# Altium schematic sheet TLD.SchDoc
size 302 x 195 mm; SheetNumber: 1; SheetTotal: 7
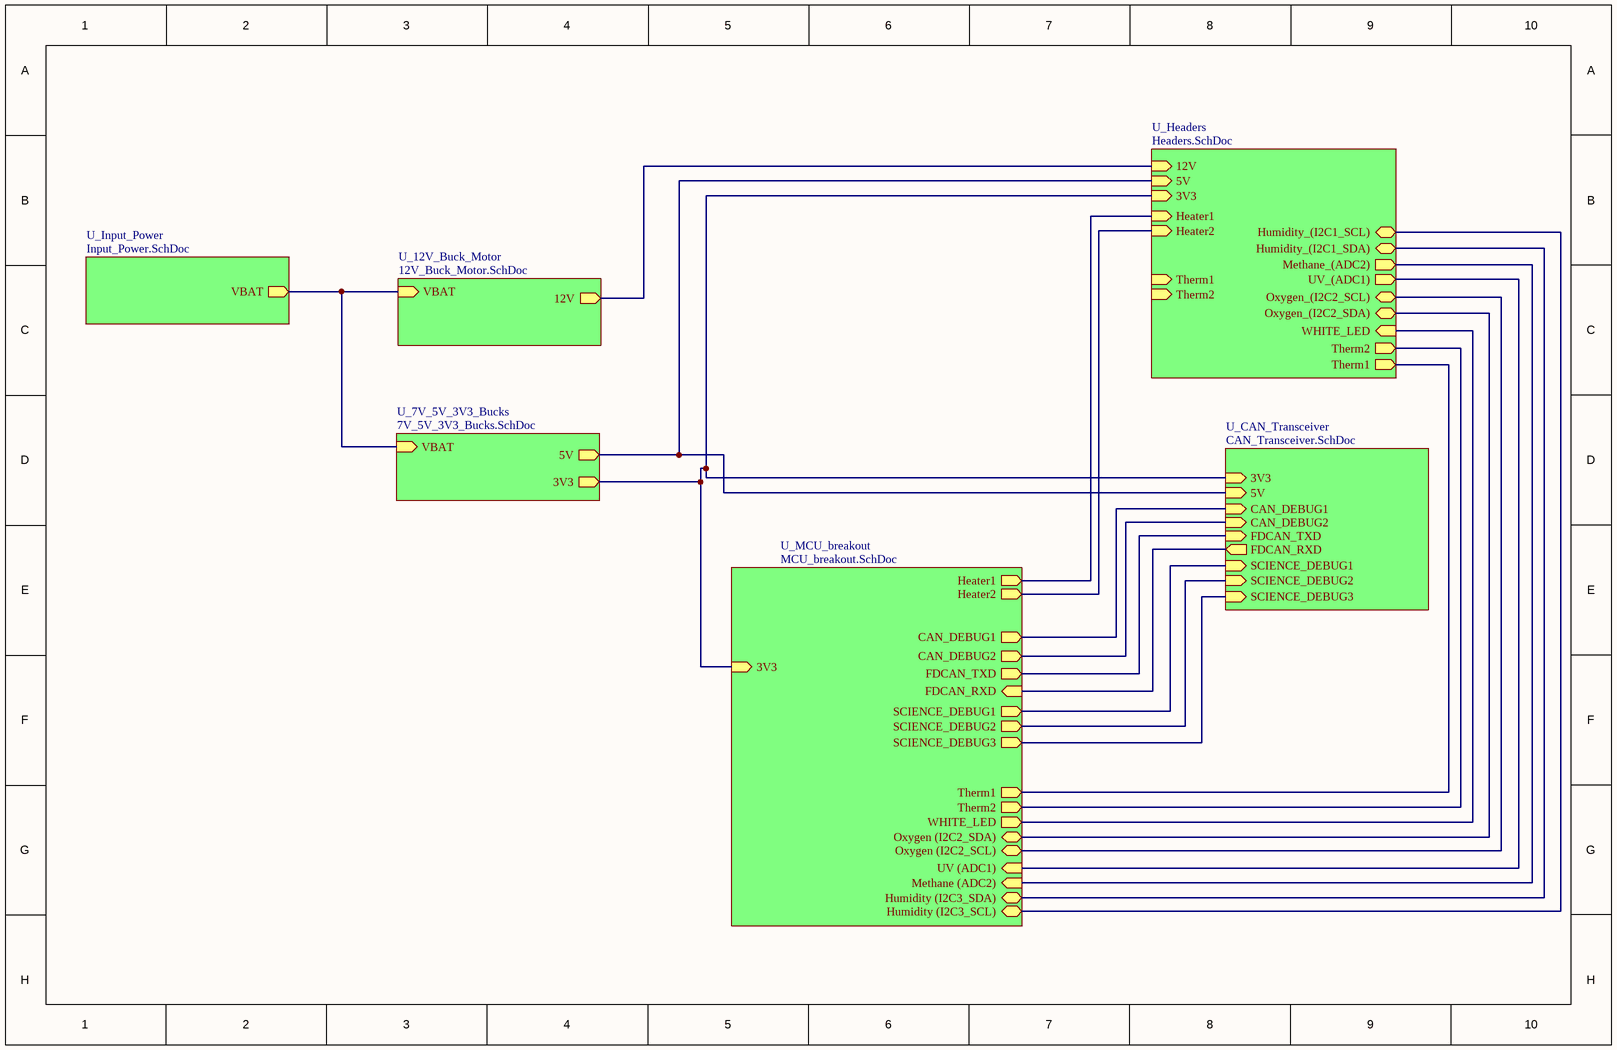
[diagram p0: TLD.SchDoc]

## Sub-sheets
U_7V_5V_3V3_Bucks = 7V_5V_3V3_Bucks.SchDoc: VBAT (in), 3V3 (out), 5V (out)
U_12V_Buck_Motor = 12V_Buck_Motor.SchDoc: 12V (out), VBAT (in)
U_CAN_Transceiver = CAN_Transceiver.SchDoc: CAN_DEBUG1 (in), CAN_DEBUG2 (in), FDCAN_TXD (in), FDCAN_RXD (out), 3V3 (in), 5V (in), SCIENCE_DEBUG1 (in), SCIENCE_DEBUG2 (in), SCIENCE_DEBUG3 (in)
U_Headers = Headers.SchDoc: Methane_(ADC2) (out), UV_(ADC1) (out), Heater1 (in), Heater2 (in), Therm1 (out), Therm2 (out), 12V (in), 5V (in), 3V3 (in), Therm1 (in), Therm2 (in), WHITE_LED (in), Humidity_(I2C1_SDA) (bidir), Humidity_(I2C1_SCL) (bidir), Oxygen_(I2C2_SCL) (bidir), Oxygen_(I2C2_SDA) (bidir)
U_Input_Power = Input_Power.SchDoc: VBAT (out)
U_MCU_breakout = MCU_breakout.SchDoc: Heater1 (out), Heater2 (out), Therm1 (out), Therm2 (out), CAN_DEBUG1 (out), CAN_DEBUG2 (out), FDCAN_TXD (out), FDCAN_RXD (in), 3V3 (in), Humidity (I2C3_SCL) (bidir), WHITE_LED (out), Oxygen (I2C2_SDA) (bidir), Oxygen (I2C2_SCL) (bidir), UV (ADC1) (in), Methane (ADC2) (in), Humidity (I2C3_SDA) (bidir), SCIENCE_DEBUG3 (out), SCIENCE_DEBUG1 (out), SCIENCE_DEBUG2 (out)

## Nets
(unnamed): sheet U_12V_Buck_Motor/12V, sheet U_Headers/12V
(unnamed): sheet U_12V_Buck_Motor/VBAT, sheet U_7V_5V_3V3_Bucks/VBAT, sheet U_Input_Power/VBAT
(unnamed): sheet U_CAN_Transceiver/CAN_DEBUG1, sheet U_MCU_breakout/CAN_DEBUG1
(unnamed): sheet U_CAN_Transceiver/CAN_DEBUG2, sheet U_MCU_breakout/CAN_DEBUG2
(unnamed): sheet U_CAN_Transceiver/FDCAN_TXD, sheet U_MCU_breakout/FDCAN_TXD
(unnamed): sheet U_CAN_Transceiver/FDCAN_RXD, sheet U_MCU_breakout/FDCAN_RXD
(unnamed): sheet U_CAN_Transceiver/3V3, sheet U_7V_5V_3V3_Bucks/3V3, sheet U_Headers/3V3, sheet U_MCU_breakout/3V3
(unnamed): sheet U_CAN_Transceiver/5V, sheet U_7V_5V_3V3_Bucks/5V, sheet U_Headers/5V
(unnamed): sheet U_CAN_Transceiver/SCIENCE_DEBUG1, sheet U_MCU_breakout/SCIENCE_DEBUG1
(unnamed): sheet U_CAN_Transceiver/SCIENCE_DEBUG2, sheet U_MCU_breakout/SCIENCE_DEBUG2
(unnamed): sheet U_CAN_Transceiver/SCIENCE_DEBUG3, sheet U_MCU_breakout/SCIENCE_DEBUG3
(unnamed): sheet U_Headers/Methane_(ADC2), sheet U_MCU_breakout/Methane (ADC2)
(unnamed): sheet U_Headers/UV_(ADC1), sheet U_MCU_breakout/UV (ADC1)
(unnamed): sheet U_Headers/Heater1, sheet U_MCU_breakout/Heater1
(unnamed): sheet U_Headers/Heater2, sheet U_MCU_breakout/Heater2
(unnamed): sheet U_Headers/Therm1, sheet U_MCU_breakout/Therm1
(unnamed): sheet U_Headers/Therm2, sheet U_MCU_breakout/Therm2
(unnamed): sheet U_Headers/WHITE_LED, sheet U_MCU_breakout/WHITE_LED
(unnamed): sheet U_Headers/Humidity_(I2C1_SDA), sheet U_MCU_breakout/Humidity (I2C3_SDA)
(unnamed): sheet U_Headers/Humidity_(I2C1_SCL), sheet U_MCU_breakout/Humidity (I2C3_SCL)
(unnamed): sheet U_Headers/Oxygen_(I2C2_SCL), sheet U_MCU_breakout/Oxygen (I2C2_SCL)
(unnamed): sheet U_Headers/Oxygen_(I2C2_SDA), sheet U_MCU_breakout/Oxygen (I2C2_SDA)

## Notes on the sheet
- DWG. NO.
- REV.
- SHT.
- REVISION
- DESCRIPTION
- DATE
- APPROVED
- THIS DOCUMENT AND THE DATA DISCLOSED HEREIN OR HEREWITH IS THE PROPERTY OF ALTIUM LIMITED AND MAY BE FREELY DISTRIBUTED IN WHOLE. NO RIGHTS ARE RESERVED OR EXPRESS OR IMPLIED WARANTEE GIVEN.
- ENG:
- DSN:
- APPROVALS
- PROJECT
- DOCUMENT REVISION:
- DESIGN ITEM:
- CHK:
- BOM:
- REFERENCE DOCUMENTS
- PROJECT REVISION:
- TITLE
- FAB DWG:
- PCB DWG:
- ASSY DWG:
- SCALE:
- SIZE
- C
- CAGE CODE
- FILE NAME
- DWG NO.
- SHEET
- OF
- REV